# Altium schematic sheet [1] - Schematic_Block.SchDoc
size 420 x 297 mm; Author: Mo3tasem; Engineer: Mo3tasem; DocumentNumber: 1; SheetNumber: 1; SheetTotal: 11
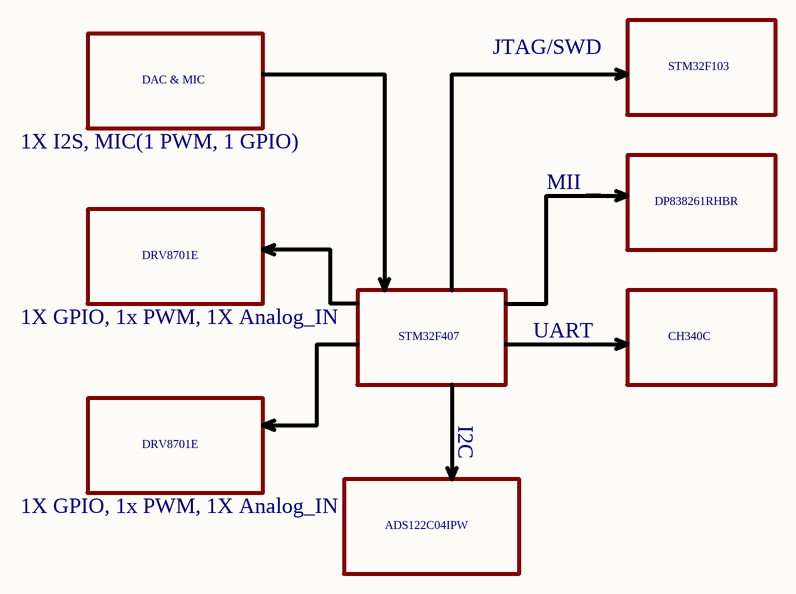
[diagram p0: [1] - Schematic_Block.SchDoc]

## Notes on the sheet
- JTAG/SWD
- STM32F103
- DAC & MIC
- 1X I2S, MIC(1 PWM, 1 GPIO)
- MII
- DP838261RHBR
- DRV8701E
- 1X GPIO, 1x PWM, 1X Analog_IN
- STM32F407
- UART
- CH340C
- I2C
- ADS122C04IPW
- THIS DOCUMENT AND THE DATA DISCLOSED HEREIN OR
- HEREWITH IS THE PROPERTY OF ALTIUM LIMITED AND MAY
- DWG NO:
- REVISION
- REV:
- DESCRIPTION
- DATE
- APPROVED
- BE FREELY DISTRIBUTED IN WHOLE. NO RIGHTS ARE
- RESERVED OR EXPRESS OR IMPLIED WARANTEE GIVEN.
- ENG:
- APPROVALS
- PROJECT
- DSN:
- CHK:
- REFERENCE DOCUMENTS
- PROJECT REVISION:
- TITLE
- DOCUMENT REVISION:
- DESIGN ITEM:
- BOM:
- FAB DWG:
- PCB DWG:
- ASSY DWG:
- SCALE:
- A3
- SIZE
- CAGE CODE
- FILE NAME
- DWG NO.
- SHEET
- OF
- REV